# Altium schematic sheet Sheet1(1).SchDoc
size A4; SheetNumber: 1; SheetTotal: 1
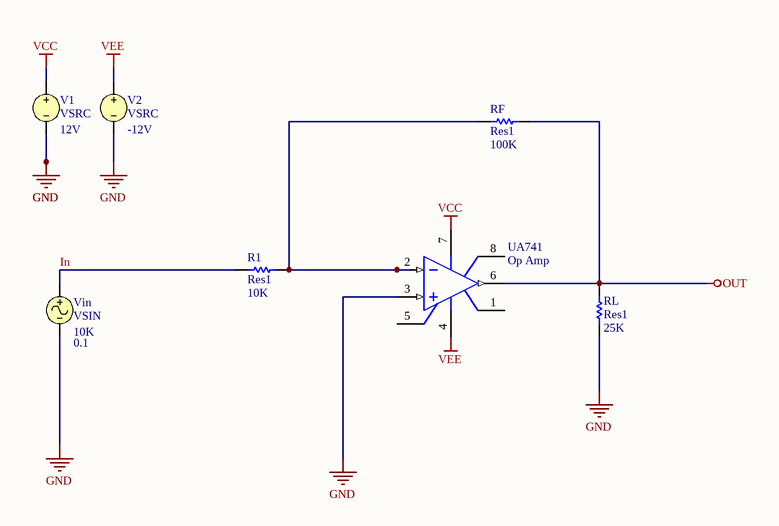
[diagram p0: Sheet1(1).SchDoc]

## Parts
R1  Res1  value 10K  [AXIAL-0.3]
RF  Res1  value 100K  [AXIAL-0.3]
RL  Res1  value 25K  [AXIAL-0.3]
UA741  Op Amp  [H-08A]
V1  VSRC  Amplitude: 12V
V2  VSRC  Amplitude: -12V
Vin  VSIN  Frequency: 10K  Amplitude: 0.1

## Nets
GND: RL.1 UA741.3(IN+) V1.2 V2.2 Vin.2
OUT: RF.2 RL.2 UA741.6(OUT)
VCC: UA741.7(V+) V1.1
VEE: UA741.4(V-) V2.1
In: R1.1 Vin.1
NetR1_2: R1.2 RF.1 UA741.2(IN-)

Not connected (* = marked no-connect by the designer): UA741 1(OS_NUL) 5(OS_NUL) 8(TAB)

## Library data of the parts
R1 RF RL = Res1: Resistor; Published: 8-Jun-2000; LatestRevisionDate: 17-Jul-2002; LatestRevisionNote: Re-released for DXP Platform.; PackageReference: AXIAL-0.3; Publisher: Altium Limited; PackageDescription: Axial Device, Thru-Hole; 2 Leads; 0.3 in Pin Spacing
UA741 = Op Amp: FET Operational Amplifier; Published: 8-Jun-2000; LatestRevisionDate: 17-Jul-2002; LatestRevisionNote: Re-released for DXP Platform.; DatasheetVersion: REV. B; PackageVersion: 1990; PackageReference: H-08A; Publisher: Altium Limited; PackageDescription: Can; 8 Leads; Pin Circle Dia. 5.08 mm; Lead Dia. 0.53 mm (max); ComponentLink1Description: Manufacturer Link; ComponentLink1URL: http://www.analog.com/
V1 = VSRC: Voltage Source; Note: PCB Footprint - Not required; Value: 12V; Published: 8-Jun-2000; LatestRevisionDate: 17-Jul-2002; LatestRevisionNote: Re-released for DXP Platform.; PackageReference: Not Applicable; Publisher: Altium Limited
V2 = VSRC: Voltage Source; Note: PCB Footprint - Not required; Published: 8-Jun-2000; LatestRevisionDate: 17-Jul-2002; LatestRevisionNote: Re-released for DXP Platform.; PackageReference: Not Applicable; Publisher: Altium Limited
Vin = VSIN: Sinusoidal Voltage Source; Note: PCB Footprint - Not required; Published: 8-Jun-2000; LatestRevisionDate: 15-Nov-2004; LatestRevisionNote: Corrected Netlist.; PackageReference: Not Applicable; Publisher: Altium Limited